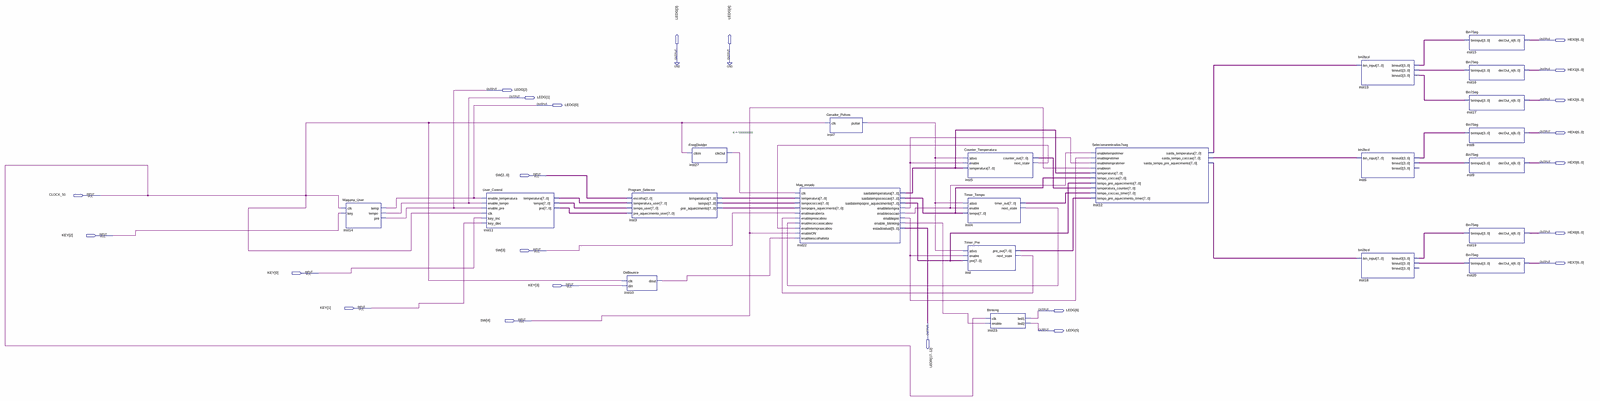
[diagram p0: schematic sheet, whole]
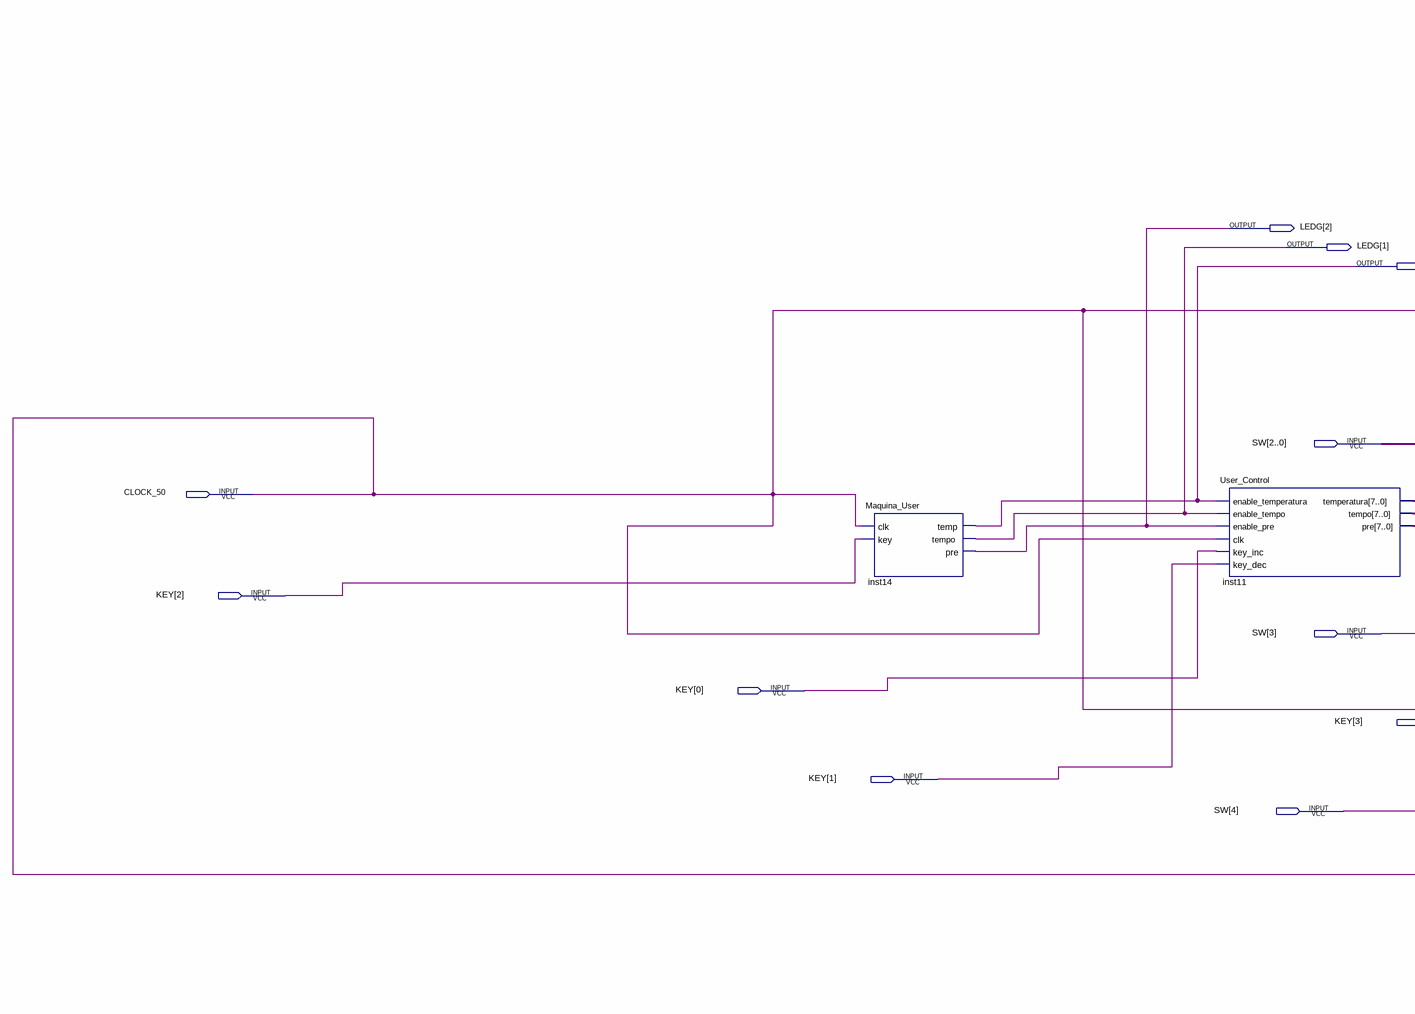
[diagram p1: schematic sheet, left part]
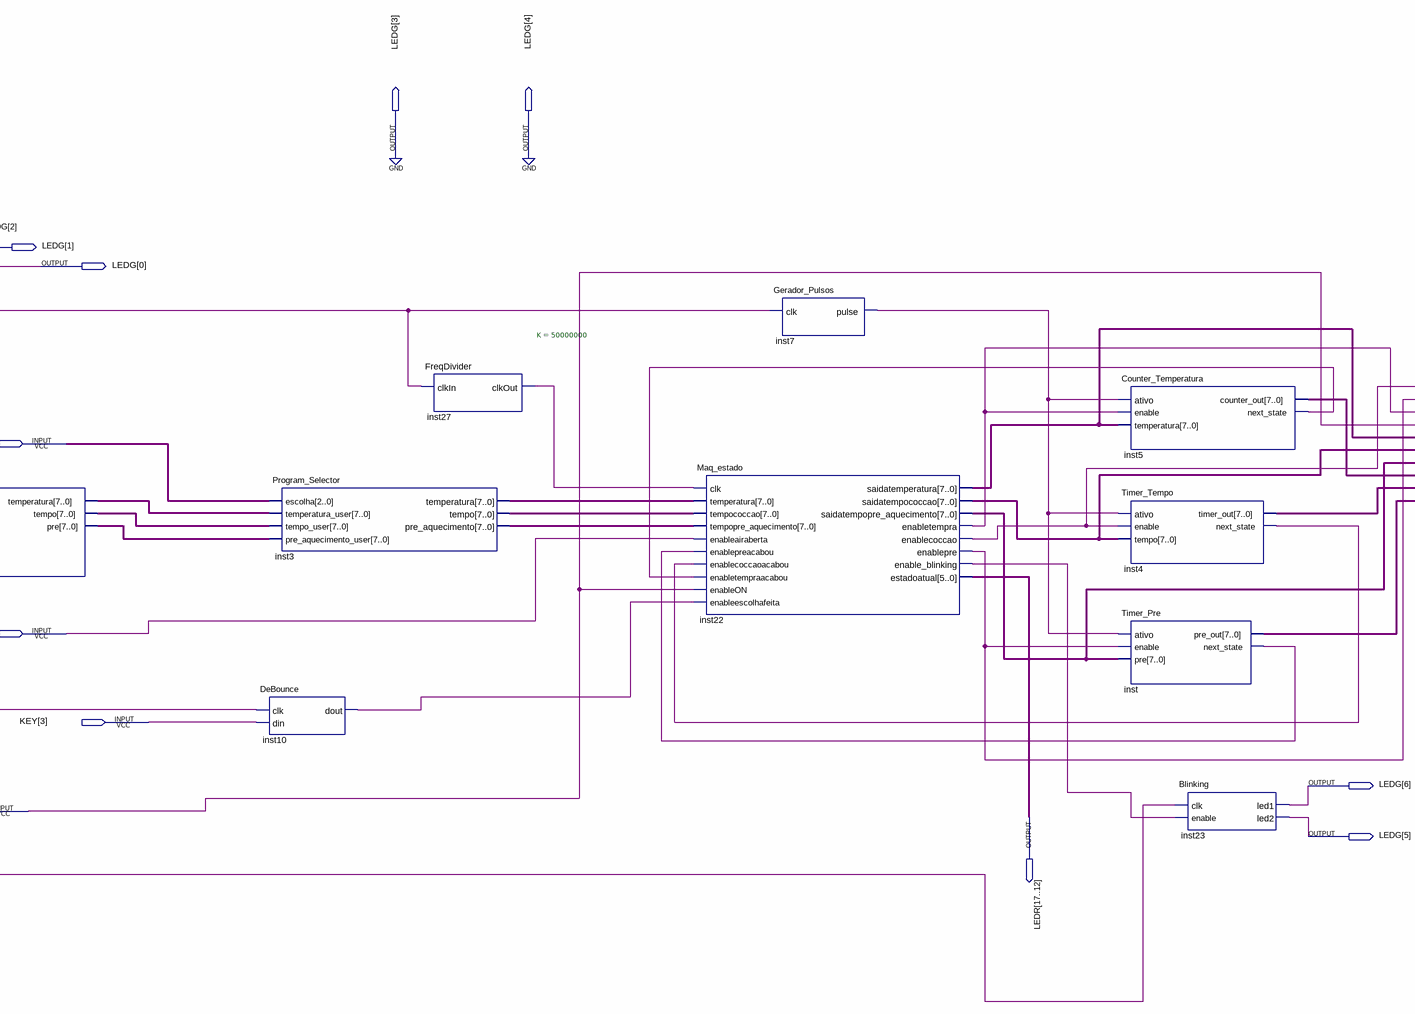
[diagram p2: schematic sheet, centre part]
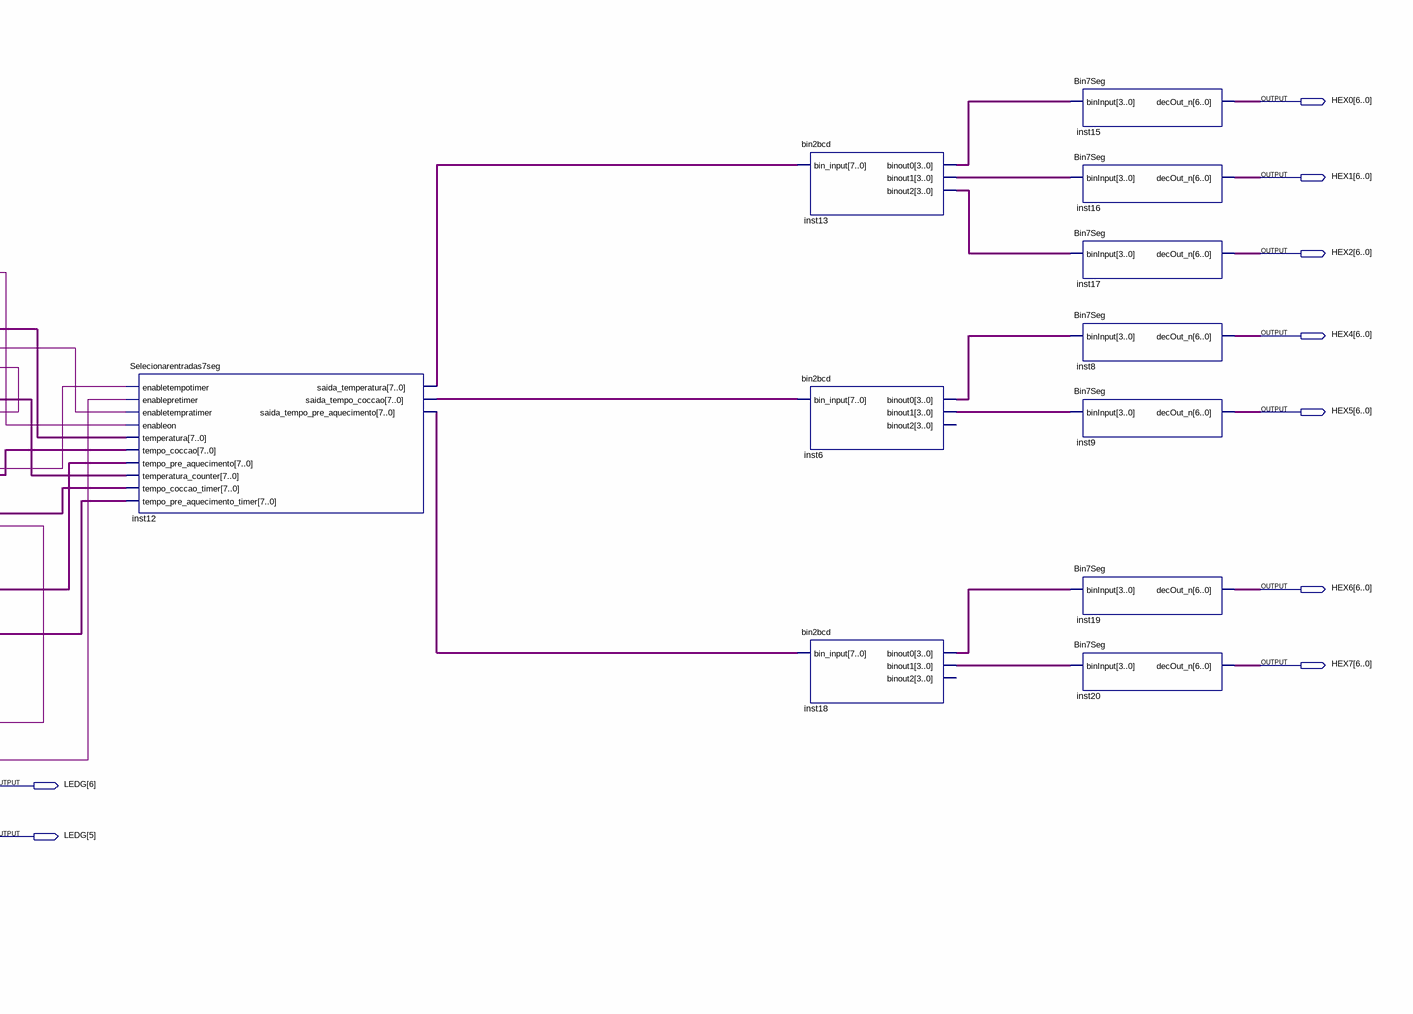
[diagram p3: schematic sheet, right part]
// Quartus schematic Teste_projeto_final.bdf as structural Verilog: 22 symbols, 23 pins
module Teste_projeto_final (
  input  [4:0] SW,
  input  CLOCK_50,
  input  [3:0] KEY,
  output [6:0] HEX0,
  output [6:0] LEDG,
  output [6:0] HEX1,
  output [6:0] HEX2,
  output [6:0] HEX4,
  output [6:0] HEX5,
  output [6:0] HEX6,
  output [6:0] HEX7,
  output [17:12] LEDR
);

  wire inst4_next_state, inst5_next_state, inst7_pulse, inst10_dout, inst22_enable_blinking,
       inst22_enablecoccao, inst22_enablepre, inst22_enabletempra, inst27_clkout, inst_next_state;
  wire [3:0] inst6_binout0, inst6_binout1, inst13_binout0, inst13_binout1, inst13_binout2, inst18_binout0,
       inst18_binout1;
  wire [7:0] inst3_pre_aquecimento, inst3_temperatura, inst3_tempo, inst4_timer_out, inst5_counter_out,
       inst11_pre, inst11_temperatura, inst11_tempo, inst12_saida_temperatura, inst12_saida_tempo_coccao,
       inst12_saida_tempo_pre_aquecimento, inst22_saidatemperatura, inst22_saidatempococcao,
       inst22_saidatempopre_aquecimento, inst_pre_out;

  Maquina_User inst14 (.clk(CLOCK_50), .key(KEY[2]), .temp(LEDG[0]), .tempo(LEDG[1]), .pre(LEDG[2]));
  User_Control inst11 (
    .enable_temperatura(LEDG[0]), .enable_tempo(LEDG[1]), .enable_pre(LEDG[2]), .clk(CLOCK_50),
    .key_inc(KEY[0]), .key_dec(KEY[1]), .temperatura(inst11_temperatura), .tempo(inst11_tempo),
    .pre(inst11_pre));
  Program_Selector inst3 (
    .escolha(SW[2:0]), .temperatura_user(inst11_temperatura), .tempo_user(inst11_tempo),
    .pre_aquecimento_user(inst11_pre), .temperatura(inst3_temperatura), .tempo(inst3_tempo),
    .pre_aquecimento(inst3_pre_aquecimento));
  DeBounce inst10 (.clk(CLOCK_50), .din(KEY[3]), .dout(inst10_dout));
  FreqDivider #(.K(50000000)) inst27 (.clkIn(CLOCK_50), .clkOut(inst27_clkout));
  Maq_estado inst22 (
    .clk(inst27_clkout), .temperatura(inst3_temperatura), .tempococcao(inst3_tempo),
    .tempopre_aquecimento(inst3_pre_aquecimento), .enableairaberta(SW[3]), .enablepreacabou(inst_next_state),
    .enablecoccaoacabou(inst4_next_state), .enabletempraacabou(inst5_next_state), .enableON(SW[4]),
    .enableescolhafeita(inst10_dout), .saidatemperatura(inst22_saidatemperatura),
    .saidatempococcao(inst22_saidatempococcao), .saidatempopre_aquecimento(inst22_saidatempopre_aquecimento),
    .enabletempra(inst22_enabletempra), .enablecoccao(inst22_enablecoccao), .enablepre(inst22_enablepre),
    .enable_blinking(inst22_enable_blinking), .estadoatual(LEDR));
  Gerador_Pulsos inst7 (.clk(CLOCK_50), .pulse(inst7_pulse));
  Counter_Temperatura inst5 (
    .ativo(inst7_pulse), .enable(inst22_enabletempra), .temperatura(inst22_saidatemperatura),
    .counter_out(inst5_counter_out), .next_state(inst5_next_state));
  Timer_Tempo inst4 (
    .ativo(inst7_pulse), .enable(inst22_enablecoccao), .tempo(inst22_saidatempococcao),
    .timer_out(inst4_timer_out), .next_state(inst4_next_state));
  Timer_Pre inst (
    .ativo(inst7_pulse), .enable(inst22_enablepre), .pre(inst22_saidatempopre_aquecimento),
    .pre_out(inst_pre_out), .next_state(inst_next_state));
  Blinking inst23 (.clk(CLOCK_50), .enable(inst22_enable_blinking), .led1(LEDG[6]), .led2(LEDG[5]));
  Selecionarentradas7seg inst12 (
    .enabletempotimer(inst22_enablecoccao), .enablepretimer(inst22_enablepre),
    .enabletempratimer(inst22_enabletempra), .enableon(SW[4]), .temperatura(inst22_saidatemperatura),
    .tempo_coccao(inst22_saidatempococcao), .tempo_pre_aquecimento(inst22_saidatempopre_aquecimento),
    .temperatura_counter(inst5_counter_out), .tempo_coccao_timer(inst4_timer_out),
    .tempo_pre_aquecimento_timer(inst_pre_out), .saida_temperatura(inst12_saida_temperatura),
    .saida_tempo_coccao(inst12_saida_tempo_coccao),
    .saida_tempo_pre_aquecimento(inst12_saida_tempo_pre_aquecimento));
  bin2bcd inst13 (
    .bin_input(inst12_saida_temperatura), .binout0(inst13_binout0), .binout1(inst13_binout1),
    .binout2(inst13_binout2));
  bin2bcd inst6 (
    .bin_input(inst12_saida_tempo_coccao), .binout0(inst6_binout0), .binout1(inst6_binout1));  // open: binout2
  bin2bcd inst18 (
    .bin_input(inst12_saida_tempo_pre_aquecimento), .binout0(inst18_binout0), .binout1(inst18_binout1));  // open: binout2
  Bin7Seg inst15 (.binInput(inst13_binout0), .decOut_n(HEX0));
  Bin7Seg inst16 (.binInput(inst13_binout1), .decOut_n(HEX1));
  Bin7Seg inst17 (.binInput(inst13_binout2), .decOut_n(HEX2));
  Bin7Seg inst8 (.binInput(inst6_binout0), .decOut_n(HEX4));
  Bin7Seg inst9 (.binInput(inst6_binout1), .decOut_n(HEX5));
  Bin7Seg inst19 (.binInput(inst18_binout0), .decOut_n(HEX6));
  Bin7Seg inst20 (.binInput(inst18_binout1), .decOut_n(HEX7));

  assign LEDG[4:3] = 2'b00;
endmodule
